# EAGLE board STM32-PROX (EAGLE 6.5.0), part 1 of 2
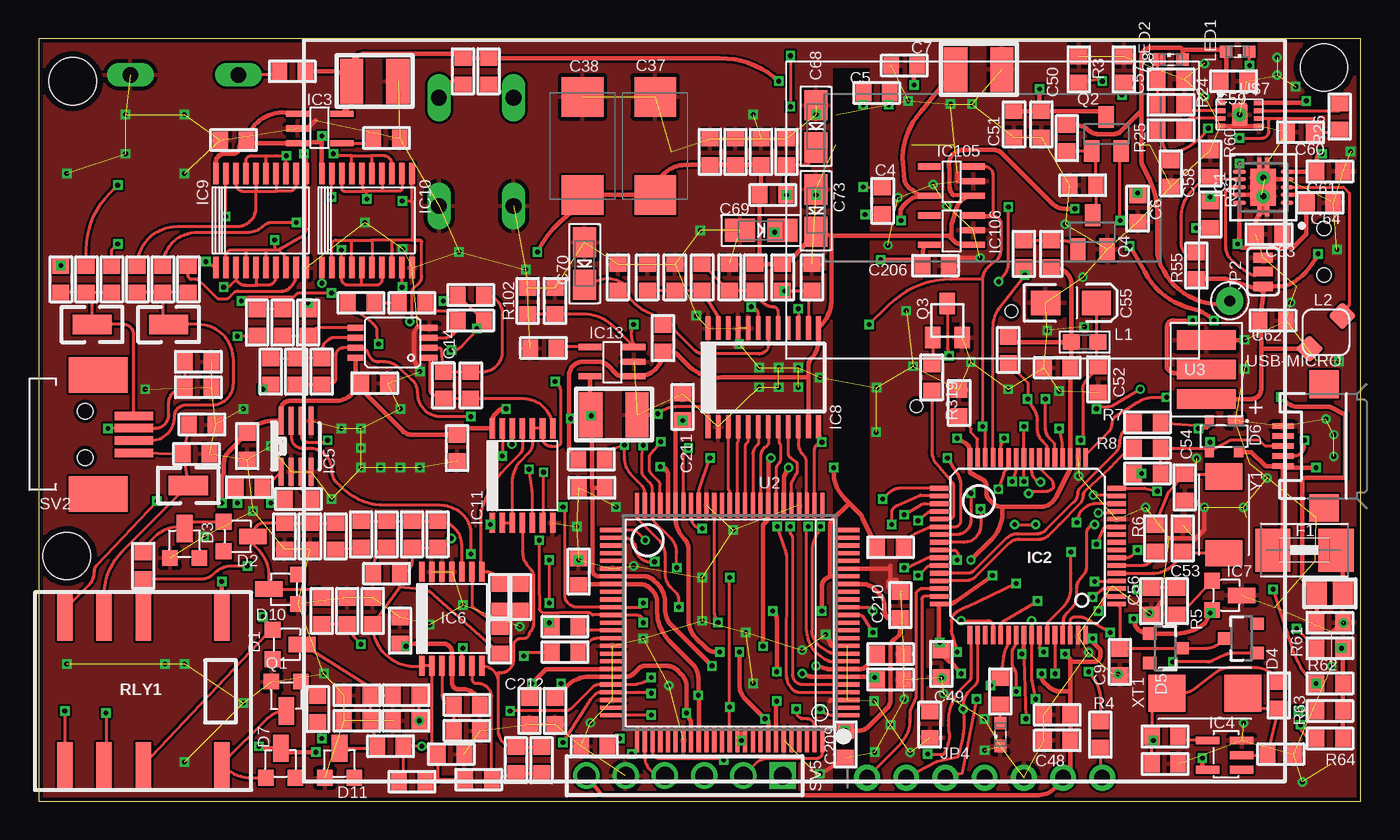
[diagram p8: board, top side]
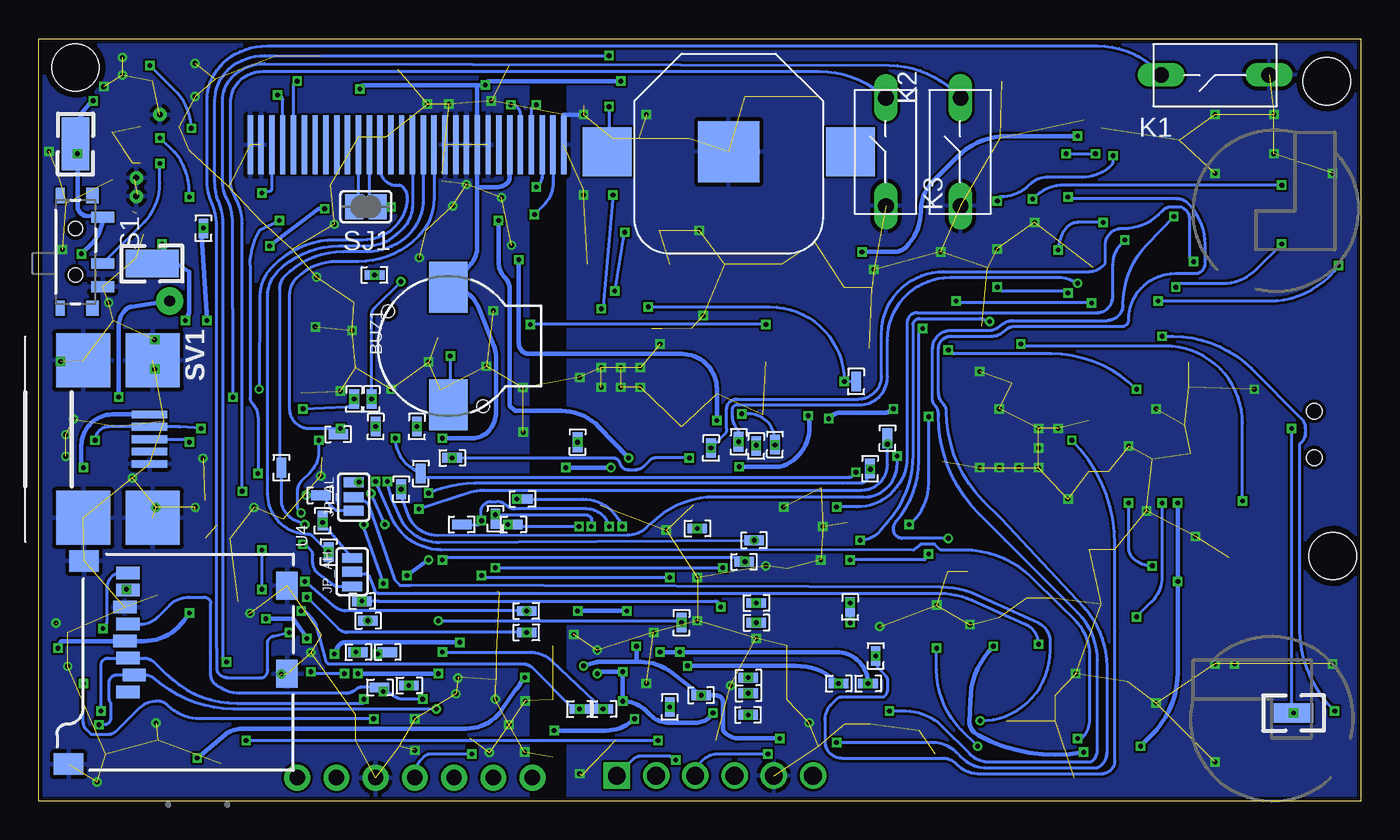
[diagram p9: board, bottom side, seen from below]

Size 85.62 x 49.37 mm. Coordinates in mm from the lower left corner, seen from the top.
Outline: 0,49.37 0,0 85.62,0 85.62,49.37 0,49.37
Copper layers (1*16): Top 0.035mm / dielectric 1.5mm / Bottom 0.035mm
Design rules "ITead_rule *": minimum track width 6mil, minimum drill 12mil, track to track 6mil, track to pad 6mil, pad to pad 6mil, via to via 6mil, smd to smd 0mil, copper to edge 10mil, drill to drill 10mil, minimum pad ring 10mil, minimum via ring 6mil, stop-mask expansion 2mil, vias tented up to drill 100mil, thermal gap 10mil
Net classes: 0 default: width 0.203 mm; 1 adc: width 0.203 mm; 2 power: width 0.279 mm, drill 0.254 mm

## Footprints (pad centres in the part's own frame; a part is rotated, then mirrored left to right if it is on the bottom)
SMD-TESTPOINT = smd 1.27 x 0.635: 1 0,0
NSL_SPARKFUN_BATTCON_12MM = smd 3.962 x 3.962: GND 0,0 | smd 3.175 x 3.175: PWR@1 -7.874,0; PWR@2 7.874,0
BUZZER = smd 3.3 x 2.5: 1 3.81,0; 2 -3.81,0 | hole 0.8: -3.897,-2.25; 2.25,3.897
RLC_0603 = smd 1 x 1.1: 1 -0.85,0; 2 0.85,0
RLC_1210 = smd 1.5 x 2.9: 1 -1.5,0; 2 1.5,0
D/7343-31R = smd 2.55 x 2.7: + 3.175,0; - -3.175,0
EIA3216-KIT = smd 1.9 x 1.6: A 1.65,0; C -1.65,0
EIA3216-18/A-R = smd 1.95 x 1.5: + 1.375,0; - -1.375,0
SOT23-3LEAD = smd 1.016 x 1.016: 1 -0.94,-0.762; 2 0.965,-0.762 | smd 1.016 x 1.778: 3 0.013,1.143
SOT23-3 = smd 0.8 x 0.9: 1 -0.95,-1; 2 0.95,-1; 3 0,1.1
USBUG_SOT143B = smd 1 x 0.7: 1 -0.75,-1 | smd 0.6 x 0.7: 2 0.95,-1; 3 0.95,1; 4 -0.95,1
1812 = smd 2.286 x 2.794: 1 -2.046,0; 2 2.046,0
RLC_0603@1 = smd 1 x 1.1: 1 -0.85,0; 2 0.85,0
QFN-10 = smd 0.28 x 0.85: 1 -1,-1.545; 2 -0.5,-1.545; 3 0,-1.545; 4 0.5,-1.545; 5 1,-1.545; 6 1,1.545; 7 0.5,1.545; 8 0,1.545; 9 -0.5,1.545; 10 -1,1.545 | smd 2.4 x 1.65: P0 0,0 | smd 0.7 x 0.28: P1 -1.55,-0.25; P2 1.55,-0.25; P3 1.55,0.25; P4 -1.55,0.25 | drill 0.381: V0 -0.6,0; V1 0.6,0
LQFP64A_PACKAGE = smd 1.2 x 0.3: 1 -5.75,3.75; 2 -5.75,3.25; 3 -5.75,2.75; 4 -5.75,2.25; 5 -5.75,1.75; 6 -5.75,1.25; 7 -5.75,0.75; 8 -5.75,0.25; 9 -5.75,-0.25; 10 -5.75,-0.75; 11 -5.75,-1.25; 12 -5.75,-1.75; 13 -5.75,-2.25; 14 -5.75,-2.75; 15 -5.75,-3.25; 16 -5.75,-3.75; 33 5.75,-3.75; 34 5.75,-3.25; 35 5.75,-2.75; 36 5.75,-2.25; 37 5.75,-1.75; 38 5.75,-1.25; 39 5.75,-0.75; 40 5.75,-0.25; 41 5.75,0.25; 42 5.75,0.75; 43 5.75,1.25; 44 5.75,1.75; 45 5.75,2.25; 46 5.75,2.75; 47 5.75,3.25; 48 5.75,3.75 | smd 0.3 x 1.2: 17 -3.75,-5.75; 18 -3.25,-5.75; 19 -2.75,-5.75; 20 -2.25,-5.75; 21 -1.75,-5.75; 22 -1.25,-5.75; 23 -0.75,-5.75; 24 -0.25,-5.75; 25 0.25,-5.75; 26 0.75,-5.75; 27 1.25,-5.75; 28 1.75,-5.75; 29 2.25,-5.75; 30 2.75,-5.75; 31 3.25,-5.75; 32 3.75,-5.75; 49 3.75,5.75; 50 3.25,5.75; 51 2.75,5.75; 52 2.25,5.75; 53 1.75,5.75; 54 1.25,5.75; 55 0.75,5.75; 56 0.25,5.75; 57 -0.25,5.75; 58 -0.75,5.75; 59 -1.25,5.75; 60 -1.75,5.75; 61 -2.25,5.75; 62 -2.75,5.75; 63 -3.25,5.75; 64 -3.75,5.75
SOT-23-5 = smd 0.4 x 1.5: 1 -0.94,-1.422; 2 0.01,-1.422; 3 0.96,-1.422; 4 0.96,1.428; 5 -0.94,1.428
SMV-5 = smd 1.5 x 0.5: 1 0,0; 2 0,-0.95; 3 0,-1.9; 4 2.2,-1.9; 5 2.2,0
SOT-23-8-OR-MSOP-8 = smd 0.325 x 1.8: 1 -0.975,-1.65; 2 -0.325,-1.65; 3 0.325,-1.65; 4 0.975,-1.65; 5 0.975,1.65; 6 0.325,1.65; 7 -0.325,1.65; 8 -0.975,1.65
TSSOP-14 = smd 1.3 x 0.36: 1 0,0; 2 0,-0.65; 3 0,-1.3; 4 0,-1.95; 5 0,-2.6; 6 0,-3.25; 7 0,-3.9; 8 6.095,-3.9; 9 6.095,-3.25; 10 6.095,-2.6; 11 6.095,-1.95; 12 6.095,-1.3; 13 6.095,-0.65; 14 6.095,0
TSSOP-24 = smd 0.3 x 1.5: 1 -2.925,-3.2; 2 -2.275,-3.2; 3 -1.625,-3.2; 4 -0.975,-3.2; 5 -0.325,-3.2; 6 0.325,-3.2; 7 0.975,-3.2; 8 1.625,-3.2; 9 2.275,-3.2; 10 2.925,-3.2; 11 3.575,-3.2; 12 4.225,-3.2; 13 4.225,3.2; 14 3.575,3.2; 15 2.925,3.2; 16 2.275,3.2; 17 1.625,3.2; 18 0.975,3.2; 19 0.325,3.2; 20 -0.325,3.2; 21 -0.975,3.2; 22 -1.625,3.2; 23 -2.275,3.2; 24 -2.925,3.2
TSSOP-20 = smd 1.4 x 0.36: 1 0,0; 2 0,-0.65; 3 0,-1.3; 4 0,-1.95; 5 0,-2.6; 6 0,-3.25; 7 0,-3.9; 8 0,-4.55; 9 0,-5.2; 10 0,-5.85; 11 6.095,-5.85; 12 6.095,-5.2; 13 6.095,-4.55; 14 6.095,-3.9; 15 6.095,-3.25; 16 6.095,-2.6; 17 6.095,-1.95; 18 6.095,-1.3; 19 6.095,-0.65; 20 6.095,0
MSOP8 = smd 0.41 x 1.02: 1 0,0; 2 0.65,0; 3 1.3,0; 4 1.95,0; 5 1.95,4.8; 6 1.3,4.8; 7 0.65,4.8; 8 0,4.8
SJ_3 = smd 0.635 x 1.27: 1 -0.889,0; 2 0,0; 3 0.965,0
1X07_ROUND = drill 1 pad 1.676: 1 -7.62,0; 2 -5.08,0; 3 -2.54,0; 4 0,0; 5 2.54,0; 6 5.08,0; 7 7.62,0
B3F-5XX = drill 1.016 long: 1 -3.501,-0.029; 2 3.501,-0.029
0603 = smd 1.1 x 1: 1 -0.85,0; 2 0.85,0
CDRH2D18 = smd 1.3 x 1.3 rotated 225: P$1 -1.061,1.061 | smd 1.3 x 1.3 rotated 315: P$2 1.061,-1.061
LED_SML0603 = smd 0.8 x 0.8: A 0.75,0; C -0.75,0
SOT23-BEC = smd 1 x 1.4: B -0.95,-1.1; C 0,1.1; E 0.95,-1.1
SOT-23-3 = smd 1 x 1.4: 1 -0.95,-1.1; 2 0.95,-1.1; 3 0,1.1
G6S-2F = smd 1 x 3: 1 -5.08,-4.78; 3 0,-4.78; 4 2.54,-4.78; 5 5.08,-4.78; 8 5.08,4.78; 9 2.54,4.78; 10 0,4.78; 12 -5.08,4.78
SWITCH-SPST-SMD-A = smd 0.7 x 1.5: 1 -2.25,-1.75; 2 -0.75,-1.75; 3 2.25,-1.75 | smd 1 x 0.6: GND1 -3.65,1; GND3 3.65,1 | smd 1 x 0.8: GND2 -3.65,-1.1; GND4 3.65,-1.1 | hole 0.9: -1.5,0; 1.5,0
SOLDERJUMPER_REFLOW = smd 1.168 x 1.6: 1 -0.762,0; 2 0.762,0
USB-MINIB-SMD = smd 2.3 x 0.5: 1 2,0.4; 2 2,-0.4; 3 2,-1.2; 4 2,-2; 5 2,-2.8 | smd 3.5 x 3.5: TAB0 -2.3,3.9; TAB1 2.2,3.9; TAB2 2.2,-6.3; TAB3 -2.3,-6.3
HIROSE-MQ172-4POS = smd 0.55 x 2.5: 1 -1.2,6.75; 2 -0.4,6.75; 3 0.4,6.75; 4 1.2,6.75 | smd 2.3 x 3.8: P$1 -3.85,4.45; P$2 3.85,4.45 | hole 1: -1.5,3.6; 1.5,3.6
HEADER-MALE-6X1-0.100-UNKEYED = drill 1.143 square: 1 0,6.35 | drill 1.143: 2 0,3.81; 3 0,1.27; 4 0,-1.27; 5 0,-3.81; 6 0,-6.35
KEYSTONE-SMD-TESTPOINT-5015 = smd 2.54 x 1.27: 1 0,0
TESTPAD-PTH-0.7MM = drill 0.7 pad 1.778: 1 0,0
--MERGED_KEYSTONE-SMD-TESTPOINT-5015 = smd 3.429 x 1.778: 1 0,0
RLC_0805 = smd 1.3 x 1.5: 1 -0.85,0; 2 0.85,0
VQ100 = smd 0.27 x 1.6: 1 -6,-7.6; 2 -5.5,-7.6; 3 -5,-7.6; 4 -4.5,-7.6; 5 -4,-7.6; 6 -3.5,-7.6; 7 -3,-7.6; 8 -2.5,-7.6; 9 -2,-7.6; 10 -1.5,-7.6; 11 -1,-7.6; 12 -0.5,-7.6; 13 0,-7.6; 14 0.5,-7.6; 15 1,-7.6; 16 1.5,-7.6; 17 2,-7.6; 18 2.5,-7.6; 19 3,-7.6; 20 3.5,-7.6; 21 4,-7.6; 22 4.5,-7.6; 23 5,-7.6; 24 5.5,-7.6; 25 6,-7.6; 51 6,7.6; 52 5.5,7.6; 53 5,7.6; 54 4.5,7.6; 55 4,7.6; 56 3.5,7.6; 57 3,7.6; 58 2.5,7.6; 59 2,7.6; 60 1.5,7.6; 61 1,7.6; 62 0.5,7.6; 63 0,7.6; 64 -0.5,7.6; 65 -1,7.6; 66 -1.5,7.6; 67 -2,7.6; 68 -2.5,7.6; 69 -3,7.6; 70 -3.5,7.6; 71 -4,7.6; 72 -4.5,7.6; 73 -5,7.6; 74 -5.5,7.6; 75 -6,7.6 | smd 1.6 x 0.27: 26 7.6,-6; 27 7.6,-5.5; 28 7.6,-5; 29 7.6,-4.5; 30 7.6,-4; 31 7.6,-3.5; 32 7.6,-3; 33 7.6,-2.5; 34 7.6,-2; 35 7.6,-1.5; 36 7.6,-1; 37 7.6,-0.5; 38 7.6,0; 39 7.6,0.5; 40 7.6,1; 41 7.6,1.5; 42 7.6,2; 43 7.6,2.5; 44 7.6,3; 45 7.6,3.5; 46 7.6,4; 47 7.6,4.5; 48 7.6,5; 49 7.6,5.5; 50 7.6,6; 76 -7.6,6; 77 -7.6,5.5; 78 -7.6,5; 79 -7.6,4.5; 80 -7.6,4; 81 -7.6,3.5; 82 -7.6,3; 83 -7.6,2.5; 84 -7.6,2; 85 -7.6,1.5; 86 -7.6,1; 87 -7.6,0.5; 88 -7.6,0; 89 -7.6,-0.5; 90 -7.6,-1; 91 -7.6,-1.5; 92 -7.6,-2; 93 -7.6,-2.5; 94 -7.6,-3; 95 -7.6,-3.5; 96 -7.6,-4; 97 -7.6,-4.5; 98 -7.6,-5; 99 -7.6,-5.5; 100 -7.6,-6
MICROBUILDER_UG-2864HSWEG01_0.96IN_WRAPAROUND = smd 0.35 x 3.81 bottom: 1 -10.15,8.96; 2 -9.45,8.96; 3 -8.75,8.96; 4 -8.05,8.96; 5 -7.35,8.96; 6 -6.65,8.96; 7 -5.95,8.96; 8 -5.25,8.96; 9 -4.55,8.96; 10 -3.85,8.96; 11 -3.15,8.96; 12 -2.45,8.96; 13 -1.75,8.96; 14 -1.05,8.96; 15 -0.35,8.96; 16 0.35,8.96; 17 1.05,8.96; 18 1.75,8.96; 19 2.45,8.96; 20 3.15,8.96; 21 3.85,8.96; 22 4.55,8.96; 23 5.25,8.96; 24 5.95,8.96; 25 6.65,8.96; 26 7.35,8.96; 27 8.05,8.96; 28 8.75,8.96; 29 9.45,8.96; 30 10.15,8.96
MICRO-SD-SOCKET-PP = smd 0.8 x 1.5: 1 -8.94,10.7; 2 -7.84,10.3; 3 -6.74,10.7; 4 -5.64,10.9; 5 -4.54,10.7; 6 -3.44,10.9; 7 -2.34,10.7; 8 -1.24,10.7 | smd 1.8 x 1.4: CD1 -2.05,0.4; CD2 -7.75,0.4 | smd 1.4 x 1.9: GND1 -13.6,14.55; GND3 -0.45,13.55
STAND-OFF-TIGHT = hole 3.048: 0,0
UDFN-EP = smd 0.3 x 0.65: 1 -0.75,-1.25; 2 -0.25,-1.25; 3 0.25,-1.25; 4 0.75,-1.25; 5 0.75,1.25; 6 0.25,1.25; 7 -0.25,1.25; 8 -0.75,1.25 | smd 1.45 x 1.05: 9 0,0 | drill 0.356: V1 0,0
BATT = smd 1.27 x 3.81: 1 -1.905,0; 2 0,0; 3 1.905,0
USB-MICROB = smd 0.35 x 1.4: D+ 0,2.65; D- -0.65,2.65; GND 1.3,2.65; ID 0.65,2.65; VBUS -1.3,2.65 | smd 1.8 x 1.9: MT1 -4,0; MT2 4,0
XTAL-SMD-CITIZEN-CS10 = smd 2.4 x 2.4: A -0.2,0; B 4.7,0
CRYSTAL-TXC-7A = smd 1.7 x 2.4: P$1 2.485,0; P$2 -2.485,0

## Placement (x,y rotation side)
ADC_CLK_TP  TESTPAD  [SMD-TESTPOINT]  50.72,23.24 90 bottom
ADC_NOE_TP  TESTPAD  [SMD-TESTPOINT]  37.95,23.1 90 bottom
BAT1  3V  [NSL_SPARKFUN_BATTCON_12MM]  40.94,42.04 0 bottom
BUZ1  BUZZER  [BUZZER]  59.1,29.46 90 bottom
C1  33nF  [RLC_0603]  83.61,11.56 0 top
C2  22pF  [RLC_0603]  80.44,3.05 0 top
C3  22pF  [RLC_0603]  72.94,2.41 0 top
C4  1uF  [RLC_0603]  54.66,38.86 90 top
C5  1uF  [RLC_0603]  54.28,45.85 0 top
C6  4.7uF  [RLC_0603]  71.17,38.35 270 top
C7  4.7uF  [RLC_0603]  56.05,47.62 180 top
C8  4.7uF  [RLC_0603]  70.28,47.37 90 top
C9  100nF  [RLC_0603]  70.02,9.02 90 top
C10  100nF  [RLC_0603]  26.72,3.05 0 top
C11  1nF  [RLC_0603]  20.62,6.86 180 top
C12  1nF  [RLC_0603]  22.78,3.56 0 top
C13  dnp  [RLC_0603]  32.56,2.67 90 top
C14  22pF  [RLC_0603]  6.78,15.24 90 top
C15  130pF  [RLC_0603]  15.92,17.14 270 top
C16  1nF  [RLC_0603]  20.88,17.27 90 top
C17  dnp  [RLC_0603]  31.16,13.21 90 top
C18  33nF  [RLC_0603]  41.19,33.91 90 top
C19  33nF  [RLC_0603]  44.75,33.91 90 top
C20  dnp  [RLC_0603]  10.33,28.45 0 top
C21  33nF  [RLC_0603]  23.41,11.05 90 top
C22  33nF  [RLC_0603]  21.76,27.05 0 top
C23  33nF  [RLC_0603]  13.51,22.99 270 top
C24  33nF  [RLC_0603]  27.1,22.86 270 top
C25  33nF  [RLC_0603]  65.96,5.59 180 top
C26  33nF  [RLC_0603]  65.96,28.07 180 top
C27  4.7uF  [RLC_1210]  21.76,46.61 0 top
C28  33nF  [RLC_0603]  33.45,5.84 270 top
C29  33nF  [RLC_0603]  34.97,14.86 90 top
C30  33nF  [RLC_0603]  35.99,3.56 180 top
C31  33nF  [RLC_0603]  55.16,9.53 0 top
C32  33nF  [RLC_0603]  55.16,7.87 0 top
C33  4.7uF  [RLC_1210]  60.88,47.37 0 top
C34  4.7uF  [RLC_1210]  37.26,25.02 0 top
C35  47pF  [RLC_0603]  10.59,24.38 0 top
C36  dnp  [RLC_0603]  10.21,22.48 0 top
C37  100uF  [D/7343-31R]  39.92,42.42 270 top
C38  100uF  [D/7343-31R]  35.23,42.42 270 top
C39  1nF  [RLC_0603]  10.33,26.8 0 top
C40  dnp  [RLC_0603]  27.99,26.92 270 top
C41  dnp  [RLC_0603]  18.34,27.81 270 top
C42  1nF  [RLC_0603]  20.88,32.26 0 top
C43  1nF  [RLC_0603]  14.14,30.99 90 top
C44  33nF  [RLC_0603]  45.13,42.04 90 top
C45  100nF  [RLC_0603]  21.64,12.32 90 top
C46  33nF  [RLC_0603]  12.62,42.8 180 top
C47  33nF  [RLC_0603]  35.82,20.3 180 top
C48  100nF  [RLC_0603]  65.96,3.94 180 top
C49  100nF  [RLC_0603]  58.47,8.89 270 top
C50  100nF  [RLC_0603]  64.94,43.81 270 top
C51  100nF  [RLC_0603]  63.17,43.81 270 top
C52  100nF  [RLC_0603]  68.63,27.3 270 top
C53  12pF  [RLC_0603]  74.09,17.02 270 top
C54  12pF  [RLC_0603]  74.22,20.32 90 top
C55  10uF  [EIA3216-KIT]  66.85,32.26 0 top
C56  100nF  [RLC_0603]  72.06,12.95 270 top
C57  100nF  [RLC_0603]  73.33,46.74 0 top
C58  100nF  [RLC_0603]  73.33,40.64 270 top
C59  1uF  [RLC_0603]  77.39,46.61 0 top
C60  100nF  [RLC_0603]  81.71,43.31 180 top
C61  1uF  [RLC_0603]  83.61,40.77 0 top
C62  10uF  [RLC_0603]  79.93,31.11 0 top
C63  100nF  [RLC_0603]  79.68,36.7 180 top
C64  10uF  [RLC_0603]  82.98,38.73 0 top
C65  100nF  [RLC_0603]  37.51,33.91 90 top
C66  100nF  [RLC_0603]  48.43,42.04 90 top
C67  100nF  [RLC_0603]  50.08,33.91 90 top
C68  4.7uF  [EIA3216-18/A-R]  50.34,43.69 270 top
C69  4.7uF  [EIA3216-18/A-R]  46.78,36.96 0 top
C70  4.7uF  [EIA3216-18/A-R]  35.35,34.8 270 top
C71  100nF  [RLC_0603]  43.48,42.04 90 top
C72  100nF  [RLC_0603]  46.78,42.04 90 top
C73  4.7uF  [EIA3216-18/A-R]  50.34,38.23 270 top
C74  10nF  [RLC_0603]  22.53,42.93 0 top
C75  10nF  [RLC_0603]  32.69,29.34 180 top
C76  2.2uF  [RLC_0603]  59.61,25.78 270 top
C77  2.2uF  [RLC_0603]  57.7,4.95 90 top
C206  4.7uF  [RLC_0603]  58.09,34.67 0 top
C209  100nF  [RLC_0603]  52.24,3.68 270 top
C210  100nF  [RLC_0603]  55.8,12.7 90 top
C211  100nF  [RLC_0603]  41.7,25.53 90 top
C212  100nF  [RLC_0603]  31.8,5.84 270 top
CROSS_HI_TP  TESTPAD  [SMD-TESTPOINT]  31.42,9.4 90 bottom
CROSS_LO_TP  TESTPAD  [SMD-TESTPOINT]  33.07,12.57 270 bottom
D1  DIODE-SMD-SOT23  [SOT23-3LEAD]  15.92,10.16 270 top
D2  DIODE-SMD-SOT23  [SOT23-3LEAD]  12.75,17.14 270 top
D3  DIODE-SMD-SOT23  [SOT23-3LEAD]  9.45,16.51 0 top
D4  PMEG4005ET  [SOT23-3]  77.9,10.54 90 top
D5  PMEG4005ET  [SOT23-3]  72.94,9.91 270 top
D6  USBUG_PRTR5V0U2X  [USBUG_SOT143B]  76.75,23.62 180 top
D7  DIODE-SMD-SOT23  [SOT23-3LEAD]  15.67,2.29 0 top
D10  DIODE-SMD-SOT23  [SOT23-3LEAD]  16.05,13.72 90 top
D11  DIODE-SMD-SOT23  [SOT23-3LEAD]  19.48,2.29 0 top
DBG_TP  TESTPAD  [SMD-TESTPOINT]  39.67,5.59 180 bottom
F1  [1812]  81.96,16.26 180 top
FB1  FERRITERLC_0603  [RLC_0603@1]  40.43,29.97 270 top
FB2\  FERRITERLC_0603  [RLC_0603@1]  48.18,33.91 90 top
FB3  FERRITERLC_0603  [RLC_0603@1]  47.54,39.24 180 top
FPGA_DOUT_TP  TESTPAD  [SMD-TESTPOINT]  43.99,11.56 270 bottom
FPGA_NINIT_TP  TESTPAD  [SMD-TESTPOINT]  58.85,22.23 0 bottom
FPGA_NINIT_TP1  TESTPAD  [SMD-TESTPOINT]  31.78,21.53 90 bottom
FPGA_NINIT_TP2  TESTPAD  [SMD-TESTPOINT]  30.65,23.5 90 bottom
IC1  [QFN-10]  79.3,39.75 90 top
IC2  STM32F1_HIGH_DENSITY_LQFP64LQFP64(10X10)  [LQFP64A_PACKAGE]  64.05,16.51 180 top
IC3  PQ1X331M2ZP-3V3-LDO-SOT-23-5  [SOT-23-5]  18.21,43.56 270 top
IC4  HCU-INVERTER  [SMV-5]  77.9,2.03 180 top
IC5  TLV3502  [SOT-23-8-OR-MSOP-8]  16.68,22.99 0 top
IC6  MCP6294  [TSSOP-14]  24.81,8.76 90 top
IC7  MCP100  [SOT23-3LEAD]  76.75,13.34 270 top
IC8  TLC5540  [TSSOP-24]  46.27,27.43 0 top
IC9  74XX244  [TSSOP-20]  11.48,34.54 90 top
IC10  74XX244  [TSSOP-20]  18.34,34.54 90 top
IC11  CD4066  [TSSOP-14]  29.38,18.03 90 top
IC13  PQ1X331M2ZP-3V3-LDO-SOT-23-5  [SOT-23-5]  37.13,28.45 90 top
IC14  AD8052  [MSOP8]  25.32,28.7 90 top
IC105  MCP1824T-250  [SOT-23-5]  59.1,40.13 90 top
IC106  MCP1824T-120  [SOT-23-5]  59.1,36.96 90 top
JP2  JUMPER-3SMD  [SJ_3]  79.3,34.29 270 top
JP4  [1X07_ROUND]  61.26,1.52 0 top
JP_AH  [SJ_3]  65.33,14.86 270 bottom
JP_AL  [SJ_3]  65.22,19.68 90 bottom
K1  [B3F-5XX]  9.45,46.99 180 bottom
K2  [B3F-5XX]  25.96,42.04 90 bottom
K3  [B3F-5XX]  30.78,42.04 90 bottom
L1  100Ohm  [0603]  67.74,29.72 0 top
L2  CDRH2D18/HPNP-2R2NC  [CDRH2D18]  83.36,30.35 90 top
LED1  [LED_SML0603]  77.64,48.51 180 top
LED2  [LED_SML0603]  73.33,48.01 0 top
LED3  [LED_SML0603]  62.28,4.32 90 top
LED_A_TP  TESTPAD  [SMD-TESTPOINT]  61.64,7.49 0 bottom
MISO_TP  TESTPAD  [SMD-TESTPOINT]  54.02,12.32 180 bottom
MOSI_TP  TESTPAD  [SMD-TESTPOINT]  54.02,10.92 180 bottom
NCS_TP  TESTPAD  [SMD-TESTPOINT]  64.69,12.95 0 bottom
OE1_TP  TESTPAD  [SMD-TESTPOINT]  42.08,22.86 270 bottom
OE2_TP  TESTPAD  [SMD-TESTPOINT]  40.29,23.27 270 bottom
OE3_TP  TESTPAD  [SMD-TESTPOINT]  39.67,8 0 bottom
OE4_TP  TESTPAD  [SMD-TESTPOINT]  39.67,6.99 0 bottom
PCK0_TP  TESTPAD  [SMD-TESTPOINT]  44.75,6.1 270 bottom
PWR_HI_TP  TESTPAD  [SMD-TESTPOINT]  39.16,12.83 0 bottom
PWR_LO_TP  TESTPAD  [SMD-TESTPOINT]  39.16,11.56 0 bottom
Q1  NPN-SOT23-2N3904  [SOT23-3LEAD]  16.05,6.99 180 top
Q2  BC817-16SMD  [SOT23-BEC]  69.13,43.18 0 top
Q3  MMBT2222  [SOT-23-3]  58.85,31.11 0 top
Q4  BC817-16SMD  [SOT23-BEC]  68.25,36.83 0 top
R1  1M  [RLC_0603@1]  80.31,6.86 90 top
R2  100  [RLC_0603@1]  72.94,4.19 180 top
R3  820K  [RLC_0603@1]  67.36,47.37 270 top
R4  10K  [RLC_0603@1]  68.75,4.32 90 top
R5  10K  [RLC_0603@1]  73.71,12.95 90 top
R6  390  [RLC_0603@1]  72.31,17.02 270 top
R7  27  [RLC_0603@1]  71.8,24.51 180 top
R8  27  [RLC_0603@1]  71.8,22.86 180 top
R9  100K  [RLC_0603@1]  27.73,6.22 0 top
R10  100K  [RLC_0603@1]  27.73,4.57 180 top
R11  510K  [RLC_0603@1]  20.62,5.21 0 top
R12  100K  [RLC_0603@1]  24.18,1.27 180 top
R13  10K  [RLC_0603@1]  28.5,1.4 0 top
R14  10K  [RLC_0603@1]  30.91,2.67 90 top
R15  10K  [RLC_0603@1]  17.57,17.14 90 top
R16  zerohm  [RLC_0603@1]  19.22,17.14 270 top
R17  10K  [RLC_0603@1]  24.18,17.27 90 top
R18  10K  [RLC_0603@1]  29.89,13.21 90 top
R19  10K  [RLC_0603@1]  29.89,10.41 90 top
R20  240K  [RLC_0603@1]  13.64,20.32 0 top
R21  24K  [RLC_0603@1]  16.81,19.56 0 top
R22  33  [RLC_0603@1]  4.75,33.78 270 top
R23  1K  [RLC_0603@1]  33.45,32.38 270 top
R24  [RLC_0603@1]  73.33,45.09 0 top
R25  [RLC_0603@1]  73.33,43.43 0 top
R26  215.9K  [RLC_0603@1]  84.25,44.32 270 top
R27  33  [RLC_0603@1]  6.4,33.78 270 top
R28  33  [RLC_0603@1]  3.1,33.78 270 top
R29  33  [RLC_0603@1]  8.05,33.78 270 top
R30  10M  [RLC_0603@1]  23.8,6.86 0 top
R31  240K  [RLC_0603@1]  23.8,5.21 0 top
R32  zerohm  [RLC_0603@1]  15.8,30.99 270 top
R33  2.4K  [RLC_0603@1]  26.21,26.92 270 top
R34  10K  [RLC_0603@1]  16.68,27.81 270 top
R35  zerohm  [RLC_0603@1]  24.18,32.26 0 top
R36  dnp  [RLC_0603@1]  25.83,17.27 90 top
R37  dnp  [RLC_0603@1]  22.53,17.27 90 top
R38  dnp  [RLC_0603@1]  22.53,14.73 180 top
R39  1K  [RLC_0603@1]  34.08,11.3 0 top
R40  10K  [RLC_0603@1]  18.08,5.97 90 top
R41  10M  [RLC_0603@1]  18.34,12.32 270 top
R42  1M  [RLC_0603@1]  19.99,12.32 270 top
R43  74.74K  [RLC_0603@1]  75.87,37.97 90 top
R44  1K  [RLC_0603@1]  34.08,9.65 0 top
R45  10K  [RLC_0603@1]  9.7,33.78 270 top
R46  10K  [RLC_0603@1]  1.44,33.78 270 top
R47  10K  [RLC_0603@1]  35.8,22.12 0 top
R48  dnp  [RLC_0603@1]  17.45,30.99 270 top
R49  2.4K  [RLC_0603@1]  27.99,31.11 180 top
R50  10K  [RLC_0603@1]  15.03,27.81 90 top
R51  2.4K  [RLC_0603@1]  27.99,32.77 0 top
R52  100  [RLC_0603@1]  46.4,33.91 90 top
R53  330  [RLC_0603@1]  42.97,33.91 90 top
R54  100  [RLC_0603@1]  39.42,33.91 270 top
R55  1.5M  [RLC_0603@1]  74.98,34.67 270 top
R56  10K  [RLC_0603@1]  66.59,42.93 270 top
R57  10K  [RLC_0603@1]  65.58,35.43 90 top
R58  10K  [RLC_0603@1]  63.8,35.43 90 top
R59  3.3K  [RLC_0603@1]  55.16,16.43 180 top
R60  150K 1%  [RLC_0603@1]  75.87,41.27 270 top
R61  10K  [RLC_0603@1]  83.61,9.91 0 top
R62  10K  [RLC_0603@1]  83.61,7.62 0 top
R63  10K  [RLC_0603@1]  83.61,5.84 0 top
R64  10K  [RLC_0603@1]  83.61,4.06 0 top
R65  330  [RLC_0603@1]  62.28,7.11 270 top
R66  10K  [RLC_0603@1]  62.78,29.21 90 top
R67  10K  [RLC_0603@1]  67.61,39.88 0 top
R68  10K  [RLC_0603@1]  71.8,21.21 180 top
R69  10K  [RLC_0603@1]  29.13,47.24 90 top
R70  10K  [RLC_0603@1]  27.48,47.24 90 top
R71  10K  [RLC_0603@1]  16.43,47.24 0 top
R102  10K  [RLC_0603@1]  31.67,32.38 90 top
R319  100  [RLC_0603@1]  57.83,27.43 270 top
RELAY_ON_TP  TESTPAD  [SMD-TESTPOINT]  63.8,24.26 270 bottom
RLY1  G6S-2H  [G6S-2F]  6.78,7.11 180 top
S1  [SWITCH-SPST-SMD-A]  83.23,35.56 90 bottom
SJ1  [SOLDERJUMPER_REFLOW]  64.44,38.48 180 bottom
SPARE_FPGA_TP  TESTPAD  [SMD-TESTPOINT]  42.97,17.65 0 bottom
SPCK_TP  TESTPAD  [SMD-TESTPOINT]  50.59,5.97 0 bottom
SV1  USB-MINIB  [USB-MINIB-SMD]  80.44,24.64 0 bottom
SV2  HIROSE-MQ172-4POS  [HIROSE-MQ172-4POS]  -0.59,23.75 270 top
SV5  HEADER-MALE-6X1  [HEADER-MALE-6X1-0.100-UNKEYED]  41.83,1.65 270 top
TP1  TESTPAD  [SMD-TESTPOINT]  32.69,27.18 270 bottom
TP2  TESTPADKEYSTONE-SMD  [KEYSTONE-SMD-TESTPOINT-5015]  4.37,5.71 0 bottom
TP3  TESTPADKEYSTONE-SMD  [KEYSTONE-SMD-TESTPOINT-5015]  9.7,20.45 180 top
TP4  TESTPADKEYSTONE-SMD  [KEYSTONE-SMD-TESTPOINT-5015]  8.43,30.86 180 top
TP5  TESTPADKEYSTONE-SMD  [KEYSTONE-SMD-TESTPOINT-5015]  3.48,30.86 180 top
TP6  TESTPAD  [SMD-TESTPOINT]  63.55,7.37 0 bottom
TP8  TESTPAD0.7MM-ROUND-DRILLED  [TESTPAD-PTH-0.7MM]  77.14,32.38 180 top
TP9  TESTPADKEYSTONE-SMD  [--MERGED_KEYSTONE-SMD-TESTPOINT-5015]  83.23,42.55 90 bottom
TP10  TESTPADKEYSTONE-SMD  [--MERGED_KEYSTONE-SMD-TESTPOINT-5015]  78.28,34.8 180 bottom
TP11  TESTPAD  [SMD-TESTPOINT]  63.04,9.65 0 bottom
TP16  TESTPAD  [SMD-TESTPOINT]  74.95,37.08 90 bottom
TP18  TESTPAD  [SMD-TESTPOINT]  33.83,7.62 0 bottom
TP19  TESTPAD  [SMD-TESTPOINT]  42.72,6.86 180 bottom
TP20  TESTPAD  [SMD-TESTPOINT]  31.92,7.62 0 bottom
TP22  TESTPAD  [SMD-TESTPOINT]  61.13,24.26 270 bottom
TP23  TESTPAD  [SMD-TESTPOINT]  63.87,34.06 180 bottom
TP24  TESTPAD  [SMD-TESTPOINT]  49.07,5.97 0 bottom
TP25  TESTPAD  [SMD-TESTPOINT]  39.92,15.49 180 bottom
TP26  TESTPAD  [SMD-TESTPOINT]  39.16,23 270 bottom
TP28  TESTPAD  [SMD-TESTPOINT]  66.21,23.75 180 bottom
TP29  TESTPAD  [SMD-TESTPOINT]  69.9,21.59 90 bottom
TP30  TESTPAD  [SMD-TESTPOINT]  66.85,16.13 90 bottom
TP31  TESTPAD  [SMD-TESTPOINT]  64.94,9.65 0 bottom
TP32  TESTPAD  [SMD-TESTPOINT]  64.31,11.68 0 bottom
TP33  TESTPAD  [SMD-TESTPOINT]  60.88,21.21 90 bottom
TP34  TESTPAD  [SMD-TESTPOINT]  62.15,20.19 90 bottom
TP35  TESTPAD  [SMD-TESTPOINT]  39.29,16.89 180 bottom
TP48  TESTPAD  [SMD-TESTPOINT]  58.21,17.91 180 bottom
TP49  TESTPAD  [SMD-TESTPOINT]  56.05,18.29 90 bottom
TP50  TESTPAD  [SMD-TESTPOINT]  54.91,17.91 0 bottom
TP51  TESTPAD  [SMD-TESTPOINT]  54.28,19.56 180 bottom
TP52  TESTPAD  [SMD-TESTPOINT]  67.23,18.16 90 bottom
TP53  TESTPAD  [SMD-TESTPOINT]  67.36,19.81 180 bottom
TP54  TESTPAD  [SMD-TESTPOINT]  65.2,26.04 270 bottom
TP55  TESTPAD  [SMD-TESTPOINT]  64.05,26.04 270 bottom
U1  FERRITE0805  [RLC_0805]  83.61,13.46 180 top
U2  XC3S50  [VQ100]  44.75,11.56 90 top
U3  UG-2864HSWEG01  [MICROBUILDER_UG-2864HSWEG01_0.96IN_WRAPAROUND]  61.77,33.53 0 top
U4  SDCARD  [MICRO-SD-SOCKET-PP]  69.13,16 90 bottom
U$1  [STAND-OFF-TIGHT]  1.83,15.88 0 top
U$2  [STAND-OFF-TIGHT]  2.21,46.61 0 top
U$4  [STAND-OFF-TIGHT]  83.23,47.5 0 top
U$7  MC34674  [UDFN-EP]  77.77,44.45 270 top
U$9  BATT  [BATT]  75.61,27.94 270 top
U$12  [L1LOGO]  5.51,38.23 0 top
U$13  [L1LOGO]  5.76,5.33 270 top
USB-MICRO  USB-MICROB  [USB-MICROB]  83.23,22.99 90 top
XT1  XTAL-SMD-CITIZEN-CS10  [XTAL-SMD-CITIZEN-CS10]  77.77,6.99 180 top
Y1  8Mhz  [CRYSTAL-TXC-7A]  76.75,18.54 270 top